# EAGLE design olimex (EAGLE 7.1.0)
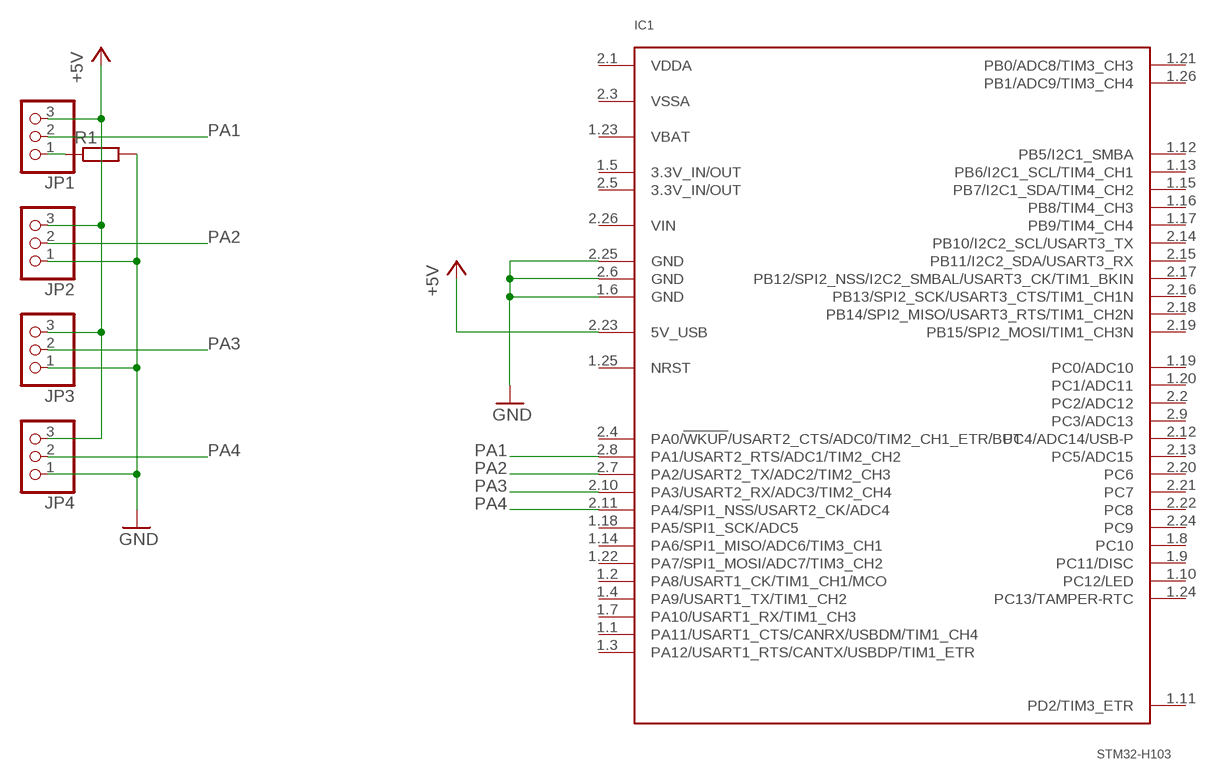
[diagram p0: schematic, sheet 1]

## Parts
IC1  STM32-H103  [OLIMEX_H103_P]
JP1  PINHD-1X3/90  [1X03/90]
JP2  PINHD-1X3/90  [1X03/90]
JP3  PINHD-1X3/90  [1X03/90]
JP4  PINHD-1X3/90  [1X03/90]
R1  R-EU_0207/10  [0207/10]

## Nets
+5V: IC1.2.23(5V_USB) JP1.3 JP2.3 JP3.3 JP4.3
GND: IC1.1.6(GND) IC1.2.6(GND) IC1.2.25(GND) JP2.1 JP3.1 JP4.1 R1.2
N$1: JP1.1 R1.1
PA1: IC1.2.8(PA1/USART2_RTS/ADC1/TIM2_CH2) JP1.2
PA2: IC1.2.7(PA2/USART2_TX/ADC2/TIM2_CH3) JP2.2
PA3: IC1.2.10(PA3/USART2_RX/ADC3/TIM2_CH4) JP3.2
PA4: IC1.2.11(PA4/SPI1_NSS/USART2_CK/ADC4) JP4.2
Unconnected: IC1.1.1(PA11/USART1_CTS/CANRX/USBDM/TIM1_CH4) IC1.1.2(PA8/USART1_CK/TIM1_CH1/MCO) IC1.1.3(PA12/USART1_RTS/CANTX/USBDP/TIM1_ETR) IC1.1.4(PA9/USART1_TX/TIM1_CH2) IC1.1.7(PA10/USART1_RX/TIM1_CH3) IC1.1.8(PC10) IC1.1.9(PC11/DISC) IC1.1.10(PC12/LED) IC1.1.11(PD2/TIM3_ETR) IC1.1.12(PB5/I2C1_SMBA) IC1.1.13(PB6/I2C1_SCL/TIM4_CH1) IC1.1.14(PA6/SPI1_MISO/ADC6/TIM3_CH1) IC1.1.15(PB7/I2C1_SDA/TIM4_CH2) IC1.1.16(PB8/TIM4_CH3) IC1.1.17(PB9/TIM4_CH4) IC1.1.18(PA5/SPI1_SCK/ADC5) IC1.1.19(PC0/ADC10) IC1.1.20(PC1/ADC11) IC1.1.21(PB0/ADC8/TIM3_CH3) IC1.1.22(PA7/SPI1_MOSI/ADC7/TIM3_CH2) IC1.1.24(PC13/TAMPER-RTC) IC1.1.25(NRST) IC1.1.26(PB1/ADC9/TIM3_CH4) IC1.2.2(PC2/ADC12) IC1.2.4(PA0/!WKUP!/USART2_CTS/ADC0/TIM2_CH1_ETR/BUT) IC1.2.9(PC3/ADC13) IC1.2.12(PC4/ADC14/USB-P) IC1.2.13(PC5/ADC15) IC1.2.14(PB10/I2C2_SCL/USART3_TX) IC1.2.15(PB11/I2C2_SDA/USART3_RX) IC1.2.16(PB13/SPI2_SCK/USART3_CTS/TIM1_CH1N) IC1.2.17(PB12/SPI2_NSS/I2C2_SMBAL/USART3_CK/TIM1_BKIN) IC1.2.18(PB14/SPI2_MISO/USART3_RTS/TIM1_CH2N) IC1.2.19(PB15/SPI2_MOSI/TIM1_CH3N) IC1.2.20(PC6) IC1.2.21(PC7) IC1.2.22(PC8) IC1.2.24(PC9)

## Power pins joined to a net without a drawn wire
3.3V_IN/OUT: IC1.1.5(3.3V_IN/OUT) IC1.2.5(3.3V_IN/OUT)
VBAT: IC1.1.23(VBAT)
VDDA: IC1.2.1(VDDA)
VIN: IC1.2.26(VIN)
VSSA: IC1.2.3(VSSA)

## Library data of the parts
IC1 = stm32:STM32-H103
JP1-JP4 = pinhead:PINHD-1X3: PIN HEADER
R1 = rcl:R-EU_: RESISTOR, European symbol

## Board
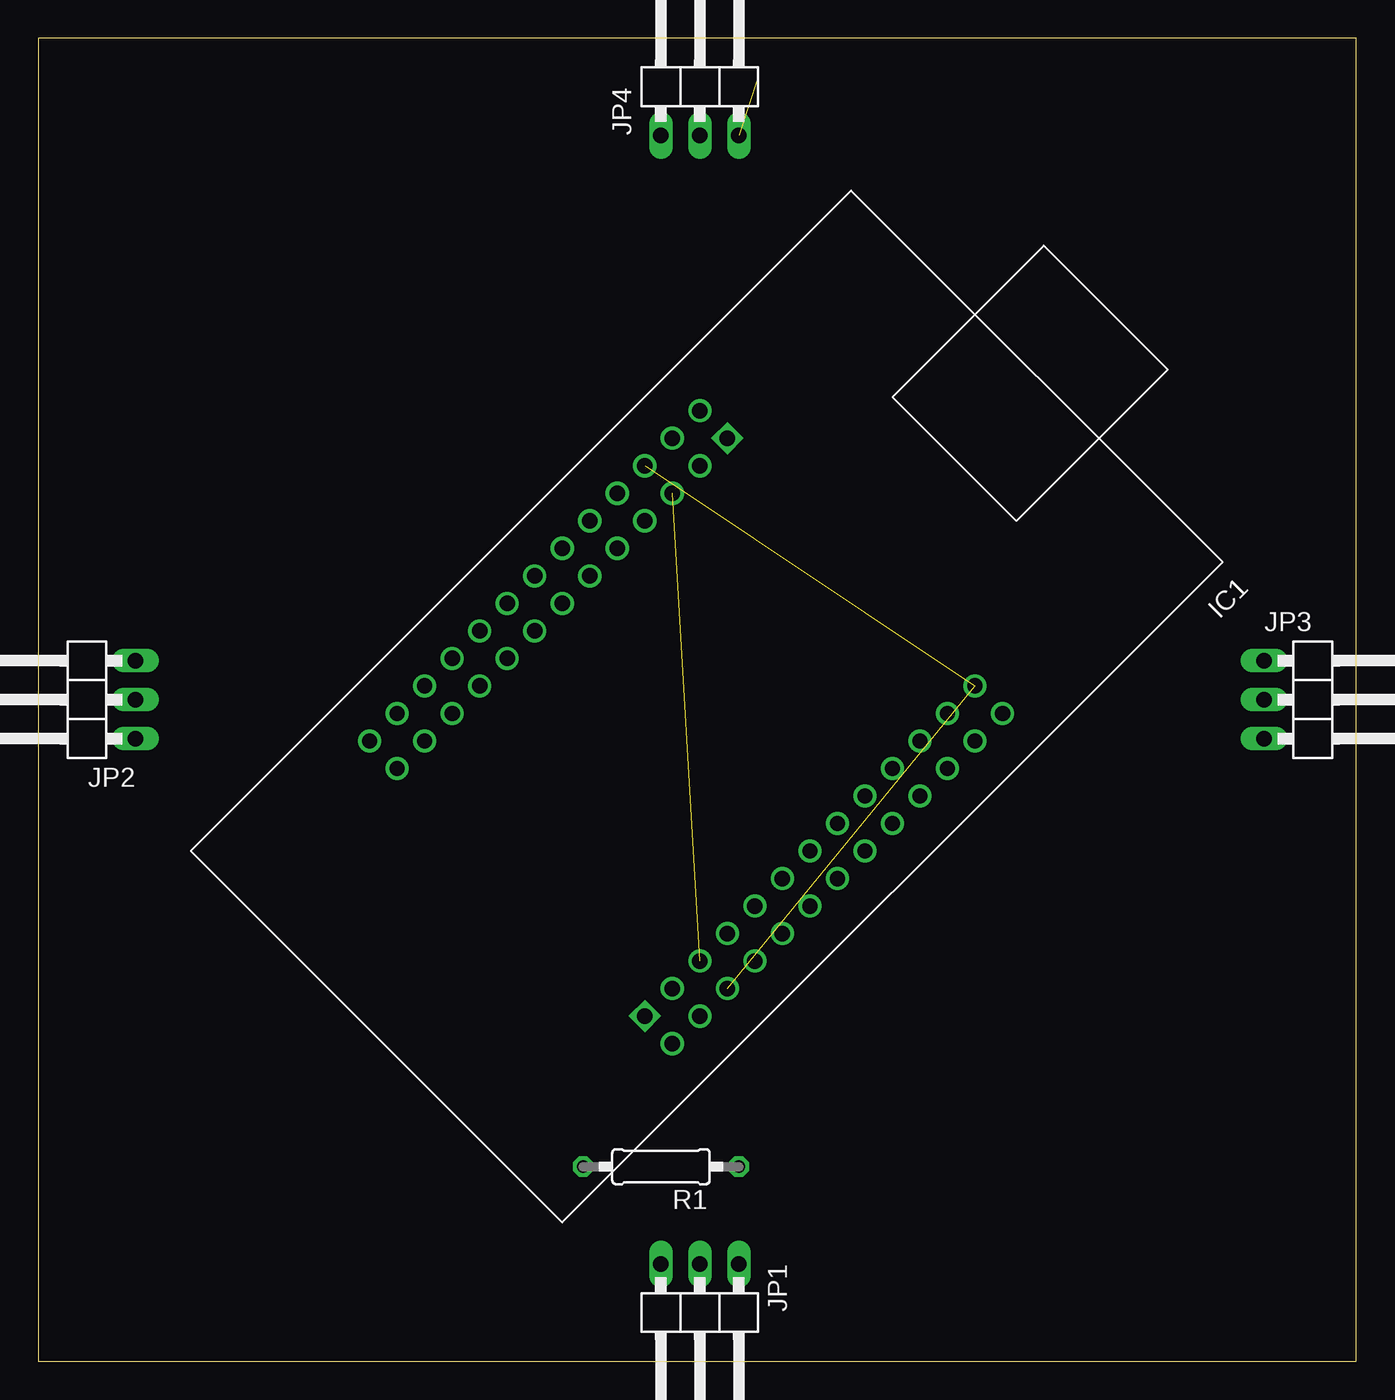
[diagram p1: board, top side]
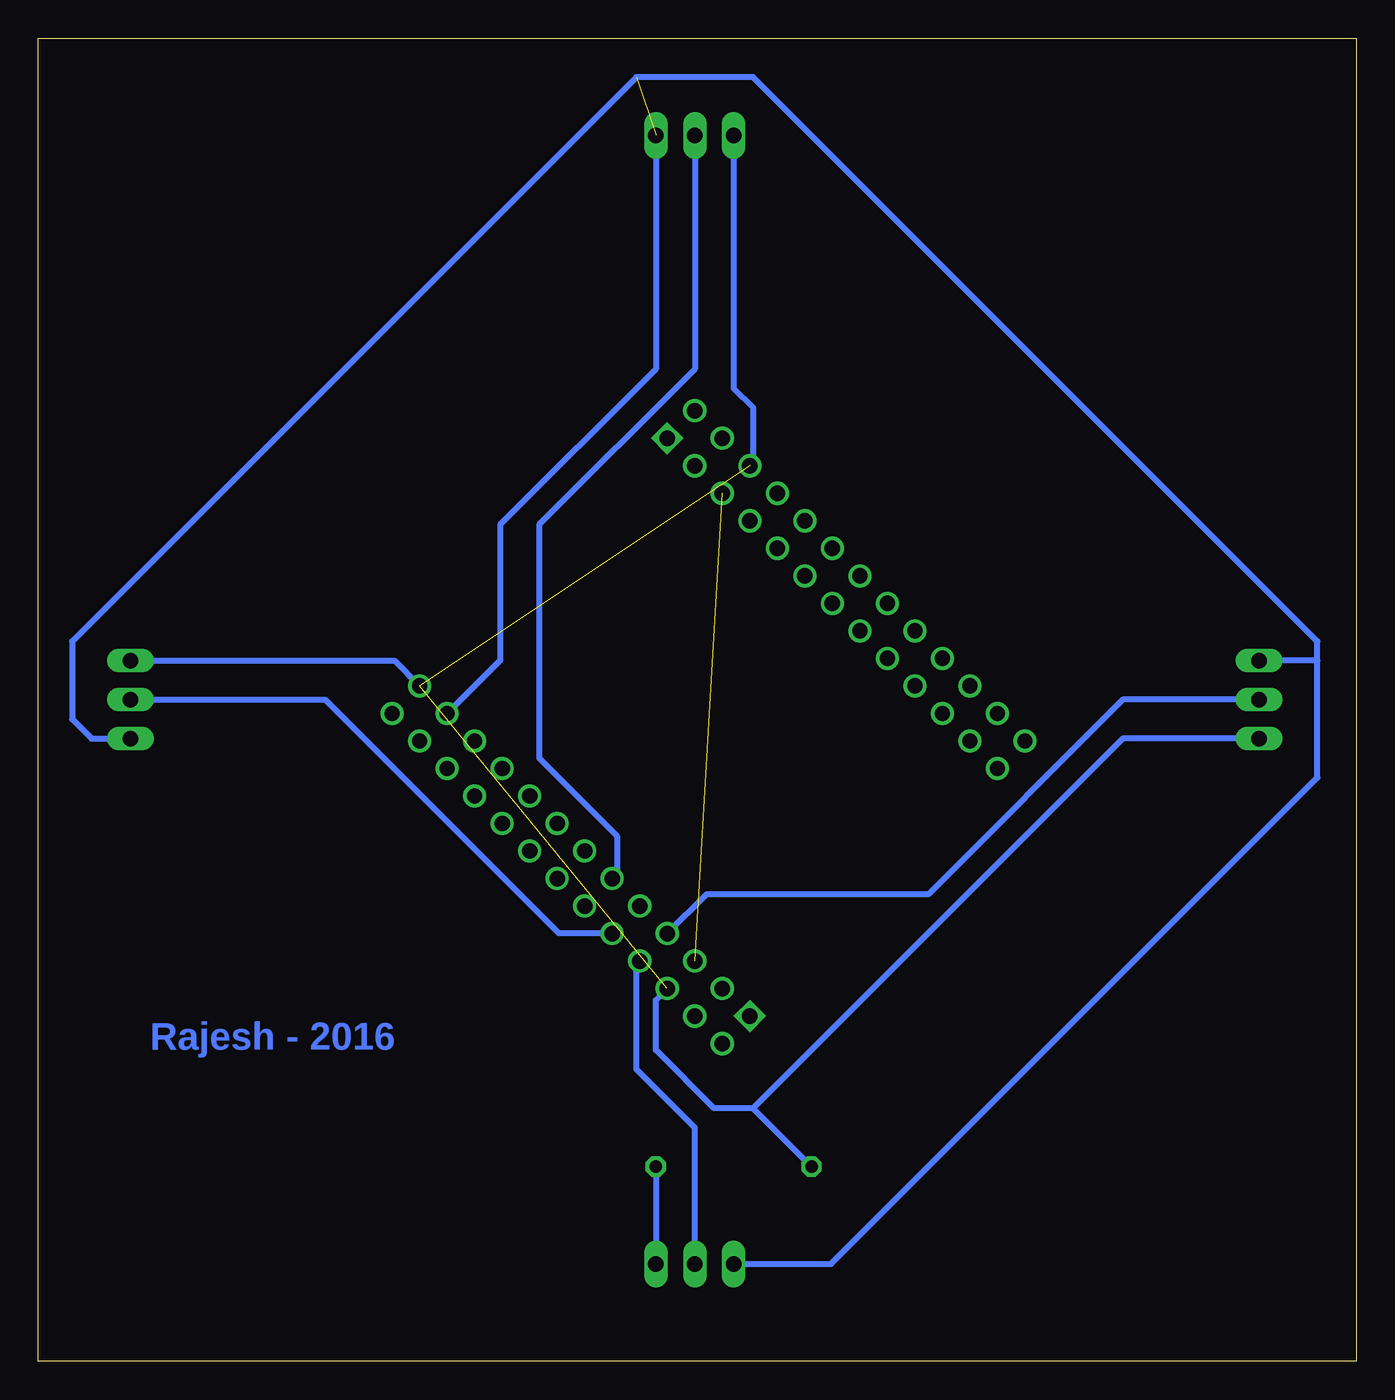
[diagram p2: board, bottom side, seen from below]

Size 86.03 x 86.35 mm. Coordinates in mm from the lower left corner, seen from the top.
Outline: 0,0 86.03,0 86.03,86.35 0,86.35 0,0
Copper layers (1*16): Top 0.035mm / dielectric 1.5mm / Bottom 0.035mm
Design rules "default": minimum track width 10mil, minimum drill 24mil, track to track 8mil, track to pad 8mil, pad to pad 8mil, via to via 8mil, smd to smd 8mil, copper to edge 40mil, drill to drill 8mil, minimum pad ring 10mil, minimum via ring 8mil, stop-mask expansion 4mil, vias tented up to drill 0mil, thermal gap 10mil

### Footprints (pad centres in the part's own frame; a part is rotated, then mirrored left to right if it is on the bottom)
OLIMEX_H103_P = drill 1 square: 1.1 -13.335,-10.795; 2.1 17.145,12.065 | drill 1: 1.2 -13.335,-13.335; 1.3 -10.795,-10.795; 1.4 -10.795,-13.335; 1.5 -8.255,-10.795; 1.6 -8.255,-13.335; 1.7 -5.715,-10.795; 1.8 -5.715,-13.335; 1.9 -3.175,-10.795; 1.10 -3.175,-13.335; 1.11 -0.635,-10.795; 1.12 -0.635,-13.335; 1.13 1.905,-10.795; 1.14 1.905,-13.335; 1.15 4.445,-10.795; 1.16 4.445,-13.335; 1.17 6.985,-10.795; 1.18 6.985,-13.335; 1.19 9.525,-10.795; 1.20 9.525,-13.335; 1.21 12.065,-10.795; 1.22 12.065,-13.335; 1.23 14.605,-10.795; 1.24 14.605,-13.335; 1.25 17.145,-10.795; 1.26 17.145,-13.335; 2.2 17.145,14.605; 2.3 14.605,12.065; 2.4 14.605,14.605; 2.5 12.065,12.065; 2.6 12.065,14.605; 2.7 9.525,12.065; 2.8 9.525,14.605; 2.9 6.985,12.065; 2.10 6.985,14.605; 2.11 4.445,12.065; 2.12 4.445,14.605; 2.13 1.905,12.065; 2.14 1.905,14.605; 2.15 -0.635,12.065; 2.16 -0.635,14.605; 2.17 -3.175,12.065; 2.18 -3.175,14.605; 2.19 -5.715,12.065; 2.20 -5.715,14.605; 2.21 -8.255,12.065; 2.22 -8.255,14.605; 2.23 -10.795,12.065; 2.24 -10.795,14.605; 2.25 -13.335,12.065; 2.26 -13.335,14.605 | drill 0.8: P$1 -13.335,-13.335
1X03/90 = drill 1.016 long: 1 -2.54,-3.81; 2 0,-3.81; 3 2.54,-3.81
0207/10 = drill 0.813 octagon: 1 -5.08,0; 2 5.08,0

### Placement (x,y rotation side)
IC1  43.18,43.18 225 top
JP1  43.18,2.54 180 top
JP2  2.54,43.18 90 top
JP3  83.82,43.18 270 top
JP4  43.18,83.82 0 top
R1  40.64,12.7 180 top

### Tracks (layer width: path | path; a pad name or v marks a point on that pad's centre or on a via)
3.3V_IN/OUT  (1 unrouted)
+5V  (1 unrouted)
  Bottom 0.406: JP4.3 45.72,64.77 55.88,54.61 55.88,45.75 IC1.2.23 | 2.54,45.72 JP2.3 | JP1.3 34.29,6.35 2.54,38.1 2.54,45.72 | 2.54,45.72 2.54,46.99 39.37,83.82 46.99,83.82 83.82,46.99 83.82,41.91 82.55,40.64 JP3.3
GND  (2 unrouted)
  Bottom 0.406: JP4.1 40.64,63.5 39.37,62.23 39.37,58.66 IC1.1.6 | JP2.1 15.24,40.64 39.37,16.51 | 39.37,16.51 41.91,16.51 45.72,20.32 45.72,23.58 IC1.2.6 | JP3.1 62.78,45.72 IC1.2.25 | R1.2 39.37,16.51
N$1
  Bottom 0.406: R1.1 JP1.1
PA1
  Bottom 0.406: JP1.2 43.18,15.24 46.99,19.05 46.99,25.9 IC1.2.8
PA2
  Bottom 0.406: JP2.2 15.24,43.18 27.94,30.48 42.41,30.48 IC1.2.7
PA3
  Bottom 0.406: JP3.2 67.31,43.18 52.07,27.94 48.6,27.94 IC1.2.10
PA4
  Bottom 0.406: JP4.2 43.18,64.77 53.34,54.61 53.34,39.37 48.26,34.29 48.26,31.81 IC1.2.11

### Text on the board
Bottom: Rajesh - 2016